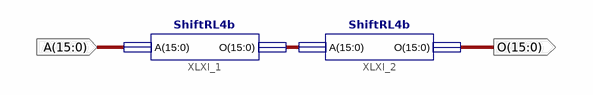
[diagram p0: schematic sheet 1]
// Xilinx ISE schematic shiftRL8b.sch (spartan3e) as structural Verilog: 2 symbols, 2 ports
module shiftRL8b (
  input  [15:0] A,
  output [15:0] O
);

  wire [15:0] XLXN_1;

  ShiftRL4b XLXI_1 (.A(A), .O(XLXN_1));
  ShiftRL4b XLXI_2 (.A(XLXN_1), .O(O));
endmodule
